# EAGLE design Segnalino (EAGLE 7.2.0)
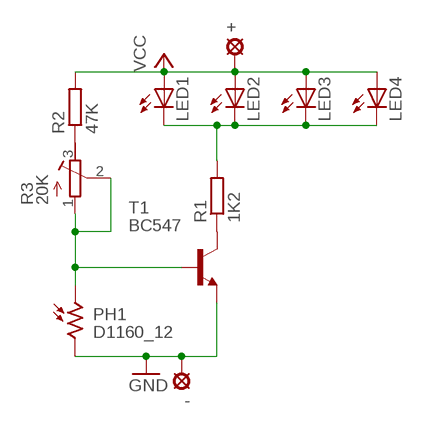
[diagram p0: schematic, sheet 1]

## Parts
+  LSP10  [LSP10]
-  LSP10  [LSP10]
LED1  LED10MM  [LED10MM]
LED2  LED10MM  [LED10MM]
LED3  LED10MM  [LED10MM]
LED4  LED10MM  [LED10MM]
PH1  D1160_12  [D11XX]
R1  1K2  R-EU_0204/2V  [0204V]
R2  47K  R-EU_0204/2V  [0204V]
R3  20K  R-TRIMM3339P  [RTRIM3339P]
T1  BC547  [TO92]

## Nets
GND: -.MP PH1.2 T1.1(E)
N$1: R1.1 T1.3(C)
N$2: R2.1 R3.3(E)
N$4: PH1.1 R3.1(A) R3.2(S) T1.2(B)
N$6: LED1.K(C) LED2.K(C) LED3.K(C) LED4.K(C) R1.2
VCC: +.MP LED1.A LED2.A LED3.A LED4.A R2.2

## Library data of the parts
+ - = solpad:LSP10: SOLDER PAD drill 1.0 mm, distributor Buerklin, 12H555
LED1-LED4 = led:LED: LED OSRAM: - CHIPLED LG R971, LG N971, LY N971, LG Q971, LY Q971, LO R971, LY R971 LH N974, LH R974 LS Q976, LO Q976, LY Q976 LO Q996 - Hyper CHIPLED LW Q18S LB Q993, LB Q99A, LB R99A - SideLED LS A670, LO A670, LY A670, LG A670, LP A670 LB A673, LV A673, LT A673, LW A673 LH A674 LY A675 LS A676, LA A676, LO A676, LY A676, LW A676 LS A679, LY A679, LG A679 - Hyper Micro SIDELED® LS Y876, LA Y876, LO Y876, LY Y876 LT Y87S - SmartLED LW L88C, LW L88S LB L89C, LB L89S, LG L890 LS L89K, LO L89K, LY L89K LS L896, LA L896, LO L896, LY L896 - TOPLED LS T670, LO T670, LY T670, LG T670, LP T670 LSG T670, LSP T670, LSY T670, LOP T670, LYG T670 LG T671, LOG T671, LSG T671 LB T673, LV T673, LT T673, LW T673 LH T674 LS T676, LA T676, LO T676, LY T676, LB T676, LH T676, LSB T676, LW T676 LB T67C, LV T67C, LT T67C, LS T67K, LO T67K, LY T67K, LW E67C LS E67B, LA E67B, LO E67B, LY E67B, LB E67C, LV E67C, LT E67C LW T67C LS T679, LY T679, LG T679 LS T770, LO T770, LY T770, LG T770, LP T770 LB T773, LV T773, LT T773, LW T773 LH T774 LS E675, LA E675, LY E675, LS T675 LS T776, LA T776, LO T776, LY T776, LB T776 LHGB T686 LT T68C, LB T68C - Hyper Mini TOPLED® LB M676 - Mini TOPLED Santana® LG M470 LS M47K, LO M47K, LY M47K Source: http://www.osram.convergy.de LUXEON: - LUMILED® LXK2-PW12-R00, LXK2-PW12-S00, LXK2-PW14-U00, LXK2-PW14-V00 LXK2-PM12-R00, LXK2-PM12-S00, LXK2-PM14-U00 LXK2-PE12-Q00, LXK2-PE12-R00, LXK2-PE12-S00, LXK2-PE14-T00, LXK2-PE14-U00 LXK2-PB12-K00, LXK2-PB12-L00, LXK2-PB12-M00, LXK2-PB14-N00, LXK2-PB14-P00, LXK2-PB14-Q00 LXK2-PR12-L00, LXK2-PR12-M00, LXK2-PR14-Q00, LXK2-PR14-R00 LXK2-PD12-Q00, LXK2-PD12-R00, LXK2-PD12-S00 LXK2-PH12-R00, LXK2-PH12-S00 LXK2-PL12-P00, LXK2-PL12-Q00, LXK2-PL12-R00 Source: www.luxeon.com KINGBRIGHT: KA-3528ASYC Source: www.kingbright.com
PH1 = photo-elements:D11: Photo Sensor Oil Burner Control Applications Source: http://optoelectronics.perkinelmer.com/content/Datasheets/DTS_PhotocellsD1160.pdf
R1 R2 = rcl:R-EU_: RESISTOR, European symbol
R3 = resistor:R-TRIMM: Trimm resistor
T1 = transistor:BC547: NPN TRANSISTOR

## Board
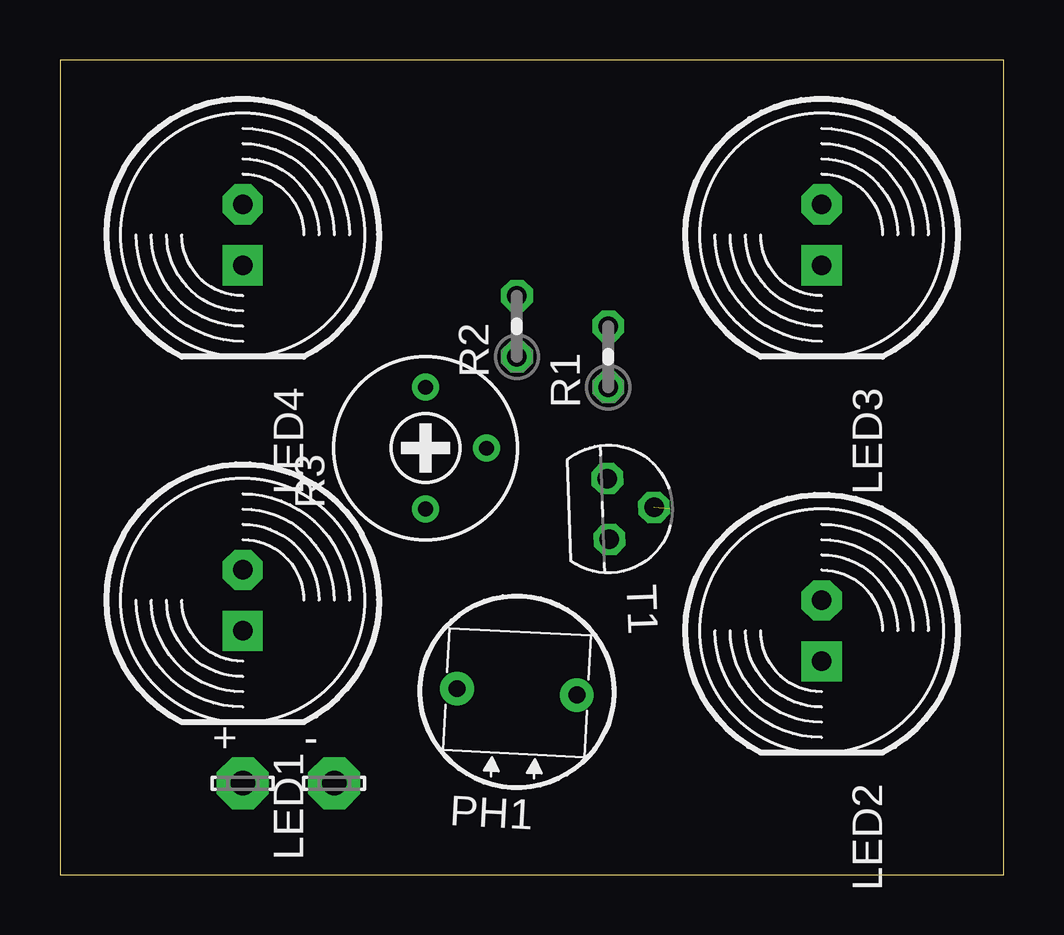
[diagram p1: board, top side]
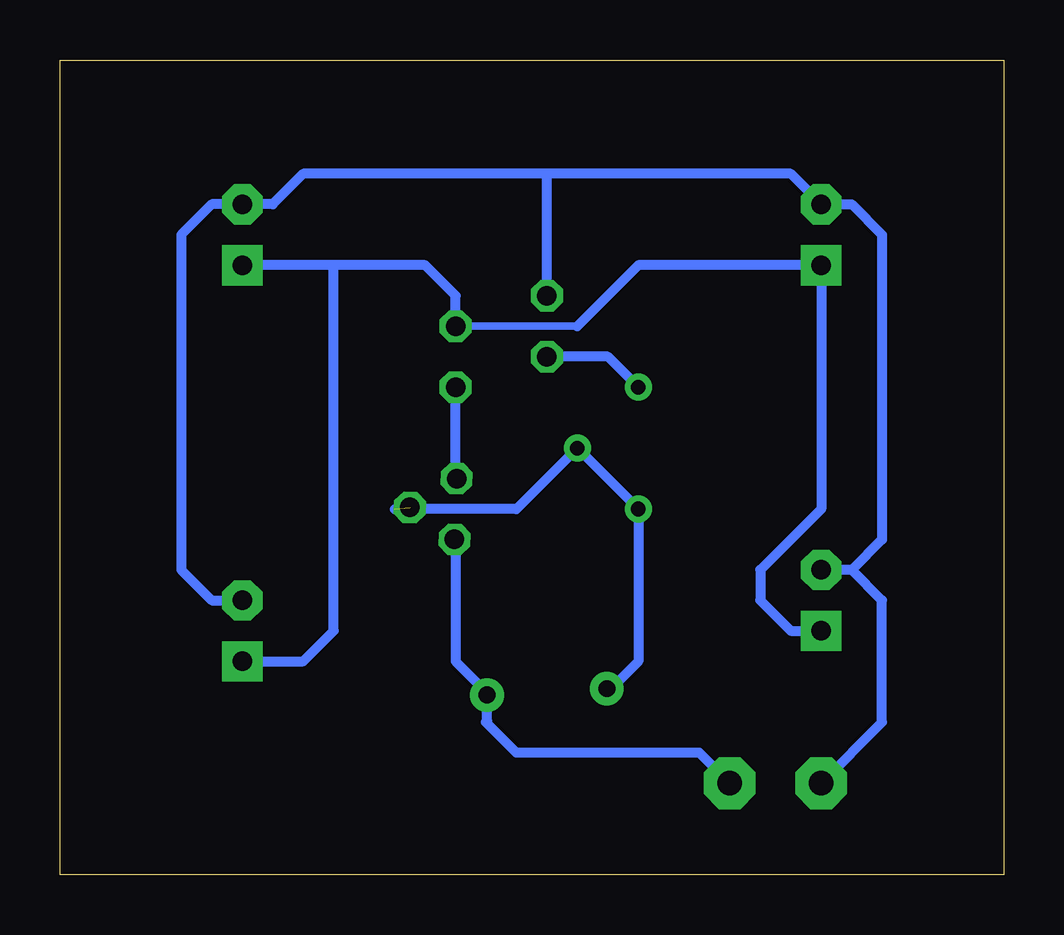
[diagram p2: board, bottom side, seen from below]

Size 39.35 x 33.96 mm. Coordinates in mm from the lower left corner, seen from the top.
Outline: 0,0 39.35,0 39.35,33.96 0,33.96 0,0
Copper layers (1*16): Top 0.035mm / dielectric 1.5mm / Bottom 0.035mm
Design rules "default": minimum track width 10mil, minimum drill 24mil, track to track 8mil, track to pad 8mil, pad to pad 8mil, via to via 8mil, smd to smd 8mil, copper to edge 40mil, drill to drill 8mil, minimum pad ring 10mil, minimum via ring 8mil, stop-mask expansion 4mil, vias tented up to drill 0mil, thermal gap 10mil

### Footprints (pad centres in the part's own frame; a part is rotated, then mirrored left to right if it is on the bottom)
LSP10 = drill 1.016 pad 2.159 octagon: MP 0,0
LED10MM = drill 0.813 pad 1.676 octagon: A -1.27,0 | drill 0.813 pad 1.676 square: K 1.27,0
D11XX = drill 0.7 pad 1.4: 1 -2.5,0; 2 2.5,0
0204V = drill 0.813 octagon: 1 -1.27,0; 2 1.27,0
RTRIM3339P = drill 0.61: 1 -2.54,0; 2 0,-2.54; 3 2.54,0
TO92 = drill 0.813 octagon: 1 1.27,0; 2 0,1.905; 3 -1.27,0

### Placement (x,y rotation side)
+  7.62,3.81 0 top
-  11.43,3.81 0 top
LED1  7.62,11.43 270 top
LED2  31.75,10.16 270 top
LED3  31.75,26.67 270 top
LED4  7.62,26.67 270 top
PH1  19.05,7.62 357 top
R1  22.86,21.59 90 top
R2  19.05,22.86 90 top
R3  15.24,17.78 90 top
T1  22.86,15.24 272 top

### Tracks (layer width: path | path; a pad name or v marks a point on that pad's centre or on a via)
GND
  Bottom 0.406: T1.1 22.86,13.97 22.86,8.89 21.55,7.58 PH1.2 21.55,6.39 21.59,6.35 20.32,5.08 12.7,5.08 -.MP
N$1
  Bottom 0.406: T1.3 22.86,16.55 R1.1
N$2
  Bottom 0.406: R3.3 16.51,21.59 R2.1
N$4  (1 unrouted)
  Bottom 0.406: 25.4,15.24 20.32,15.24 R3.2 R3.1 15.24,8.89 16.38,7.75 PH1.1
N$6
  Bottom 0.305: 17.78,22.86 R1.2
  Bottom 0.406: R1.2 22.86,24.13 24.13,25.4 27.94,25.4 | 27.94,25.4 LED3.K | LED1.K 8.89,10.16 10.16,11.43 10.16,12.7 7.62,15.24 LED4.K 15.24,25.4 17.78,22.86 | LED2.K 29.21,8.89 27.94,10.16 27.94,25.4
VCC
  Bottom 0.406: 19.05,29.21 8.89,29.21 LED4.A 6.35,27.94 5.08,26.67 5.08,13.97 6.35,12.7 | 19.05,29.21 29.21,29.21 30.48,27.94 LED3.A 33.02,27.94 34.29,26.67 34.29,12.7 33.02,11.43 LED2.A | R2.2 19.05,29.21 | 6.35,12.7 LED1.A | +.MP 5.08,6.35 5.08,11.43 6.35,12.7